# EAGLE design MiiScoreBoard (EAGLE 7.1.0)
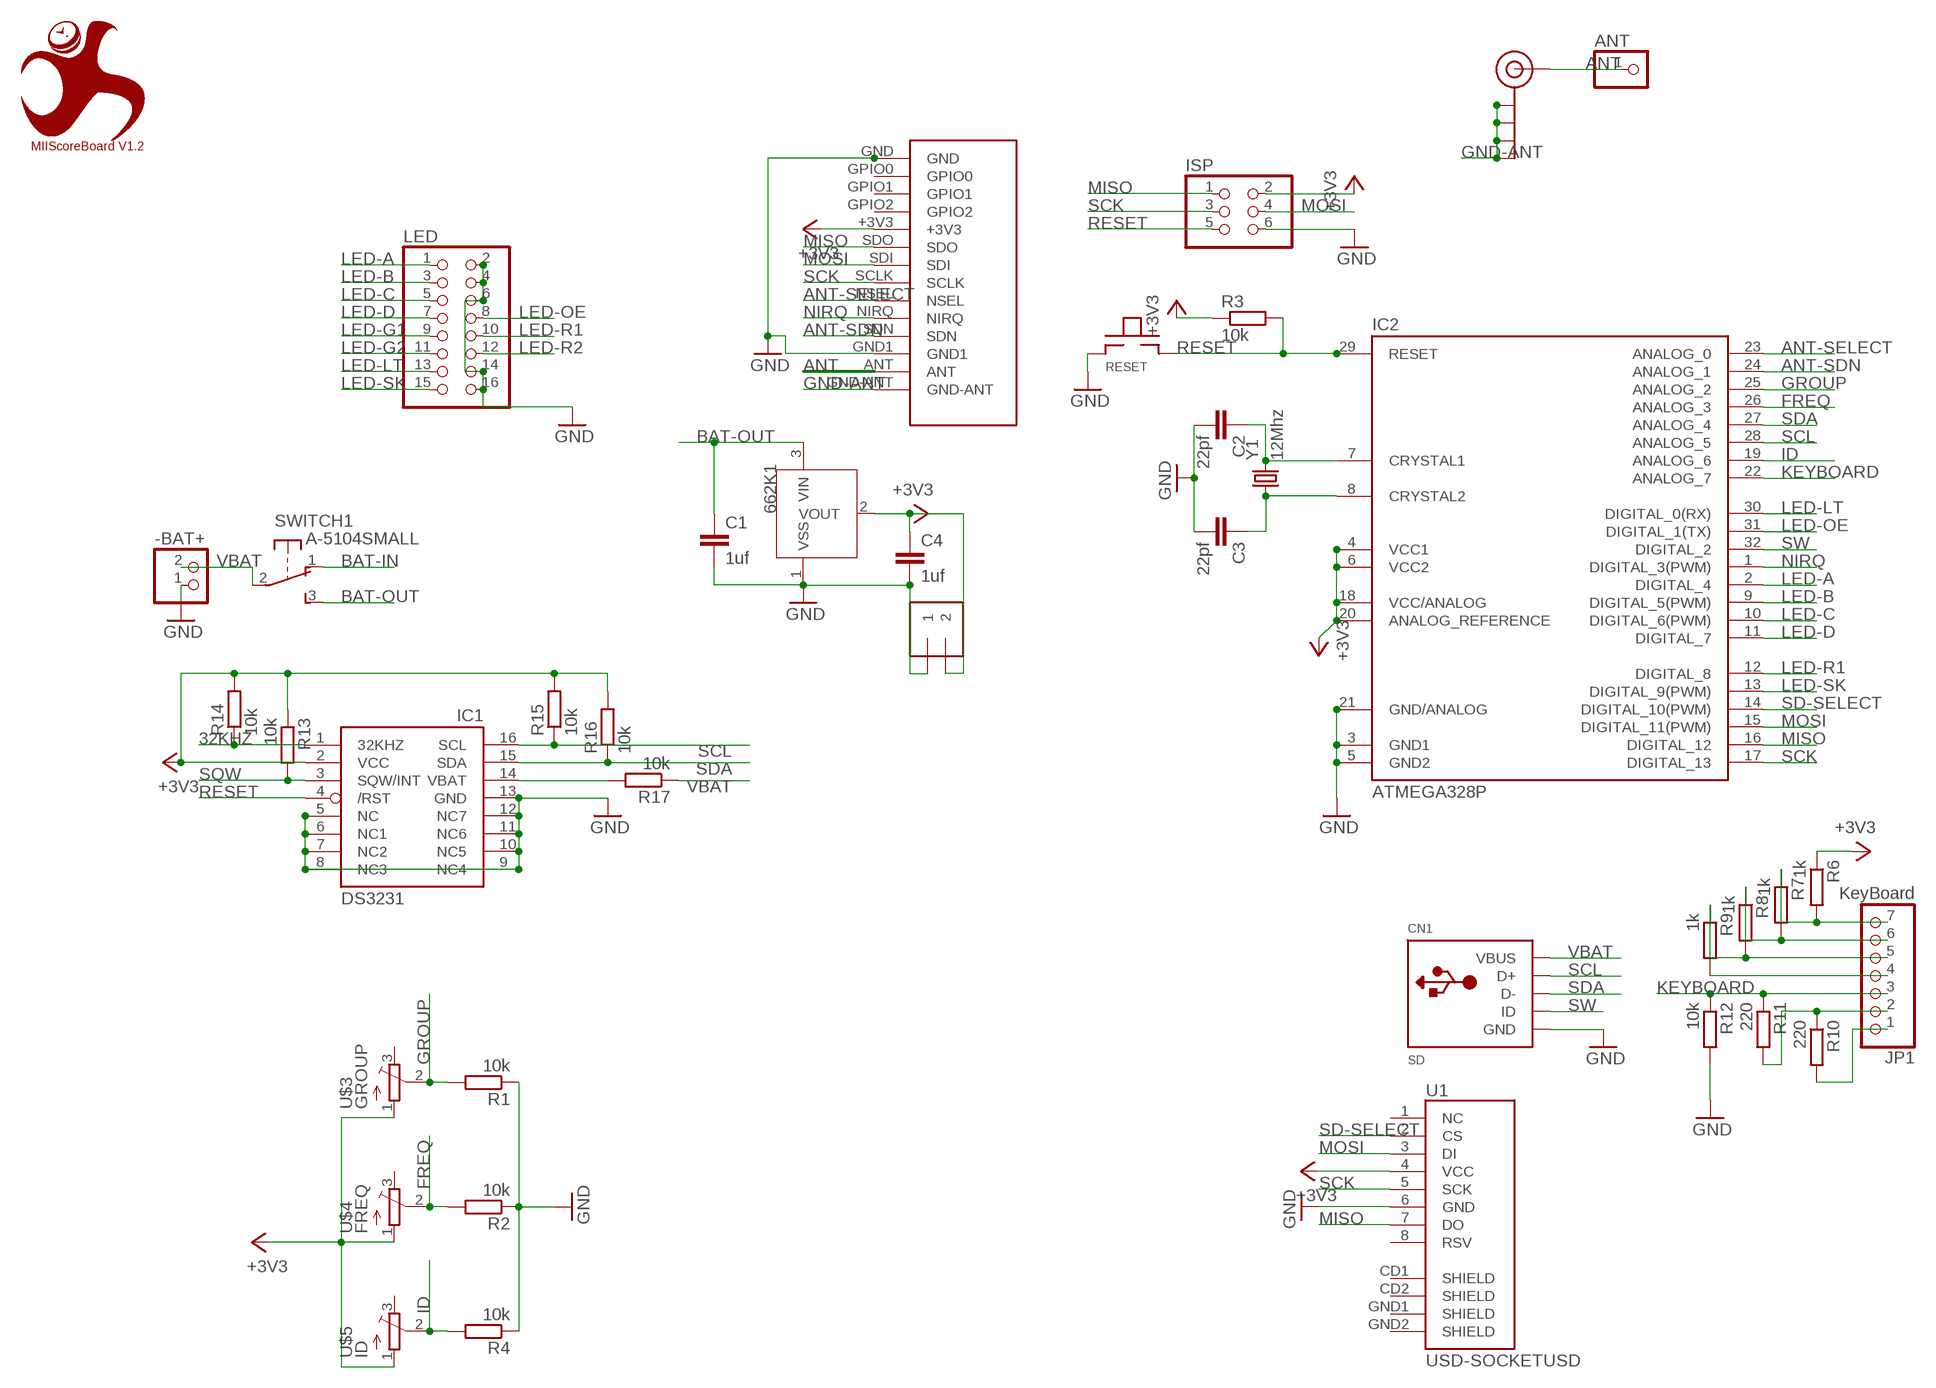
[diagram p0: schematic, sheet 1]

## Parts
662K1  XC6206  [SOT23]
+LED-  -BAT+  1X2-3.5MM  [1X2-3.5MM]
-BAT+  JST_2PIN-THM  [JST-PH-2-THM]
ANT  PINHD-1X01_2.00  [1X01M]
C1  1uf  C-EUC0805  [C0805]
C2  22pf  C-EUC0805  [C0805]
C3  22pf  C-EUC0805  [C0805]
C4  1uf  C-EUC0805  [C0805]
CN1  SD  USBMINIB  [USB-MINIB]
IC1  DS3231/SO  [SO16W]
IC2  ATMEGA328P  ATMEGA168-AU  [TQFP32-08]
ISP  PINHD-2X03_2.00  [2X03M]
J$1  SMA_EDGE  [SMA-EDGE]
JP1  KeyBoard  PINHD-1X07_2.54  [1X07]
LED  PINHD-2X08_2.54  [2X08]
R1  10k  R-EU_R0805  [R0805]
R2  10k  R-EU_R0805  [R0805]
R3  10k  R-EU_R0805  [R0805]
R4  10k  R-EU_R0805  [R0805]
R6  1k  R-EU_R0805  [R0805]
R7  1k  R-EU_R0805  [R0805]
R8  1k  R-EU_R0805  [R0805]
R9  1k  R-EU_R0805  [R0805]
R10  220  R-EU_R0805  [R0805]
R11  220  R-EU_R0805  [R0805]
R12  10k  R-EU_R0805  [R0805]
R13  10k  R-EU_R0805  [R0805]
R14  10k  R-EU_R0805  [R0805]
R15  10k  R-EU_R0805  [R0805]
R16  10k  R-EU_R0805  [R0805]
R17  10k  R-EU_R0805  [R0805]
RESET  TACT  [TACT-TS-1289]
SWITCH  A-5104SMALL  [A-5104-SMALL]
U1  USD-SOCKETUSD  [USD-SOCKET-PP]
U$1  MIIScoreBoard V1.2  MIICHRONO  [MIICHRONO]
U$3  GROUP  TRIMPOTTC33X  [TC33X]
U$4  FREQ  TRIMPOTTC33X  [TC33X]
U$5  ID  TRIMPOTTC33X  [TC33X]
U$7  SI4432  SPI4432  [SI4432]
Y1  12Mhz  CRYSTALSMD  [HC49UP]

## Nets
32KHZ: IC1.1(32KHZ) R14.1
+3V3 [supply]: 662K1.2(VOUT) +LED-.2 C4.1 IC1.2(VCC) IC2.4(VCC1) IC2.6(VCC2) IC2.18(VCC/ANALOG) IC2.20(ANALOG_REFERENCE) ISP.2 R3.1 R6.1 R13.1 R14.2 R15.2 R16.2 U1.4(VCC) U$3.1(A) U$4.1(A) U$5.1(A) U$7.+3V3
ANT [antenna]: ANT.1 J$1.SIG(SIGNAL) U$7.ANT
ANT-SDN: IC2.24(ANALOG_1) U$7.SDN
ANT-SELECT: IC2.23(ANALOG_0) U$7.NSEL
BAT-IN [supply]: SWITCH.1(1:O)
BAT-OUT [supply]: 662K1.3(VIN) C1.1 SWITCH.3(1:S)
FREQ: IC2.26(ANALOG_3) R2.2 U$4.2(S)
GND [supply]: 662K1.1(VSS) +LED-.1 -BAT+.1 C1.2 C2.2 C3.2 C4.2 CN1.GND IC1.5(NC) IC1.6(NC1) IC1.7(NC2) IC1.8(NC3) IC1.9(NC4) IC1.10(NC5) IC1.11(NC6) IC1.12(NC7) IC1.13(GND) IC2.3(GND1) IC2.5(GND2) IC2.21(GND/ANALOG) ISP.6 LED.2 LED.4 LED.6 LED.14 LED.16 R1.1 R2.1 R4.1 R12.2 RESET.TOP-1 U1.6(GND) U$7.GND U$7.GND1
GND-ANT [antenna]: J$1.GND@0(GND) J$1.GND@1(GND) J$1.GND@2(GND) J$1.GND@3(GND) U$7.GND-ANT
GROUP: IC2.25(ANALOG_2) R1.2 U$3.2(S)
ID: IC2.19(ANALOG_6) R4.2 U$5.2(S)
KEYBOARD: IC2.22(ANALOG_7) JP1.3 R11.1 R12.1
LED-A: IC2.2(DIGITAL_4) LED.1
LED-B: IC2.9(DIGITAL_5(PWM)) LED.3
LED-C: IC2.10(DIGITAL_6(PWM)) LED.5
LED-D: IC2.11(DIGITAL_7) LED.7
LED-G1: LED.9
LED-G2: LED.11
LED-LT: IC2.30(DIGITAL_0(RX)) LED.13
LED-OE: IC2.31(DIGITAL_1(TX)) LED.8
LED-R1: IC2.12(DIGITAL_8) LED.10
LED-R2: LED.12
LED-SK: IC2.13(DIGITAL_9(PWM)) LED.15
MISO: IC2.16(DIGITAL_12) ISP.1 U1.7(DO) U$7.SDO
MOSI: IC2.15(DIGITAL_11(PWM)) ISP.4 U1.3(DI) U$7.SDI
N$1: JP1.4 R9.2
N$2: JP1.7 R6.2 R7.1
N$3: JP1.6 R7.2 R8.1
N$4: JP1.5 R8.2 R9.1
N$5: JP1.1 R10.2
N$8: C3.1 IC2.8(CRYSTAL2) Y1.1
N$9: C2.1 IC2.7(CRYSTAL1) Y1.2
N$10: JP1.2 R10.1 R11.2
N$16: IC1.14(VBAT) R17.2
NIRQ: IC2.1(DIGITAL_3(PWM)) U$7.NIRQ
RESET: IC1.4(/RST) IC2.29(RESET) ISP.5 R3.2 RESET.BOT-2
SCK: IC2.17(DIGITAL_13) ISP.3 U1.5(SCK) U$7.SCLK
SCL: CN1.D+ IC1.16(SCL) IC2.28(ANALOG_5) R15.1
SD-SELECT: IC2.14(DIGITAL_10(PWM)) U1.2(CS)
SDA: CN1.D- IC1.15(SDA) IC2.27(ANALOG_4) R16.1
SQW: IC1.3(SQW/INT) R13.2
SW: CN1.ID IC2.32(DIGITAL_2)
VBAT [supply]: -BAT+.2 CN1.VBUS R17.1 SWITCH.2(1:P)
Unconnected: SWITCH.MT1(MT) SWITCH.MT2(MT) U1.1(NC) U1.8(RSV) U1.CD1(SHIELD) U1.CD2(SHIELD) U1.GND1(SHIELD) U1.GND2(SHIELD) U$3.3(E) U$4.3(E) U$5.3(E) U$7.GPIO0 U$7.GPIO1 U$7.GPIO2

## Library data of the parts
662K1 = MyLib:XC6206
+LED- = adafruit:1X2: 3.5mm Terminal block http://www.ladyada.net/library/pcb/eaglelibrary.html
-BAT+ = adafruit:JST_2PIN: JST 2-Pin Connectors of various flavors SMT-RA (S2B-PH-SM4) 4UConnector #17311 SMT (B2B-PH-SM4) THM-RA (S2B-PH) THM (B2B-PH)
ANT = pinhead-2:PINHD-1X01: PIN HEADER
C1-C4 = rcl:C-EU: CAPACITOR, European symbol
CN1 = adafruit:USB: USB Connectors USBMINIB - Surface Mount Female Mini-B USB Connector 4UConnector: 06564 By microbuilder.eu Thru-hole RA Female Mini-B USB Connector 4UConnector: 18732 By ladyada.net
IC1 = adafruit:DS3231
IC2 = Arduino-AVR:ATMEGA168
ISP = pinhead-2:PINHD-2X03: PIN HEADER
J$1 = SparkFun:SMA_EDGE: SMA Antenna Connector End launch SMA connector. The paste layer has been removed so that the connector can be hand soldered onto the board after reflow.
JP1 = pinhead-2:PINHD-1X07: PIN HEADER
LED = pinhead-2:PINHD-2X08: PIN HEADER
R1-R4 R6-R17 = rcl:R-EU_: RESISTOR, European symbol
RESET = MyLib:TACT
SWITCH = MyLib:A-5104: E-Switch right-angle slide SPDT Ebay and taydaElectronics A-5014
U1 = MyLib:USD-SOCKET: microSD Socket Part found on EBay
U$1 = MyLib:MIICHRONO
U$3-U$5 = MyLib:TRIMPOT: SMT trimmer potentiometer part number TC33X http://www.ladyada.net/library/eagle
U$7 = MyLib:SPI4432
Y1 = SparkFun:CRYSTAL: Crystals Various standard crystals. Proven footprints. Spark Fun Electronics SKU : COM-00534

## Net classes
0 default: width 0.203 mm
1 supply: width 0.254 mm
2 antenna: width 0.254 mm

## Board
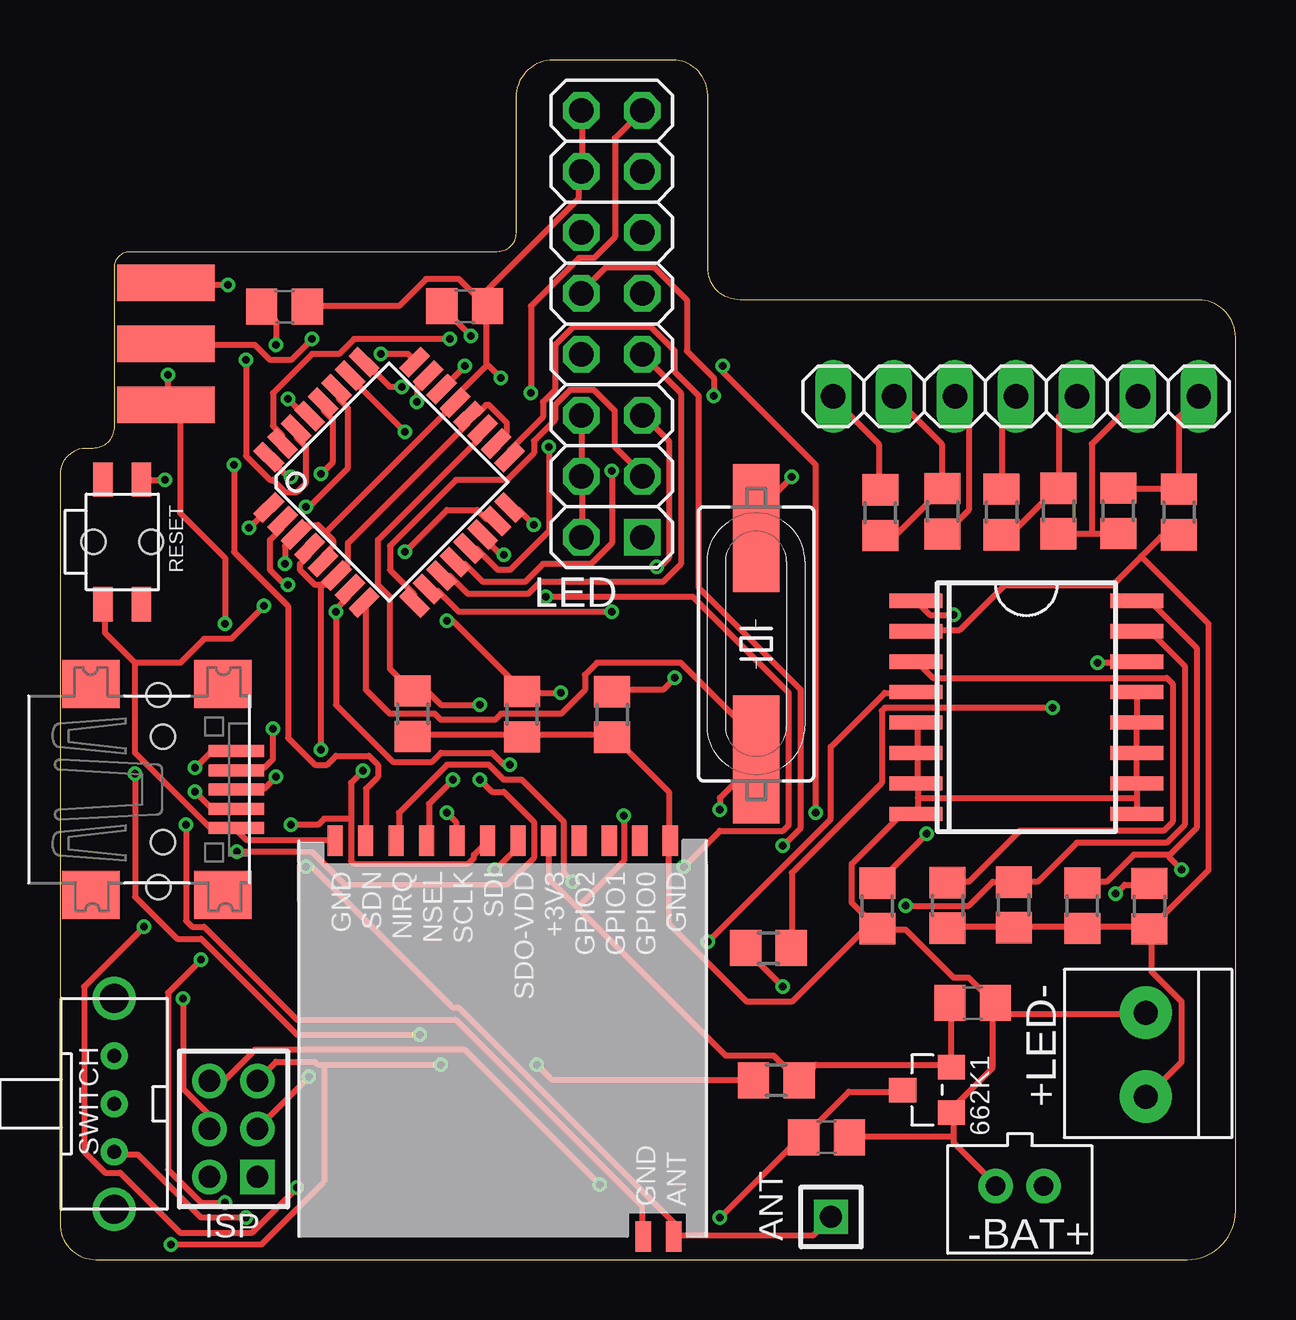
[diagram p1: board, top side]
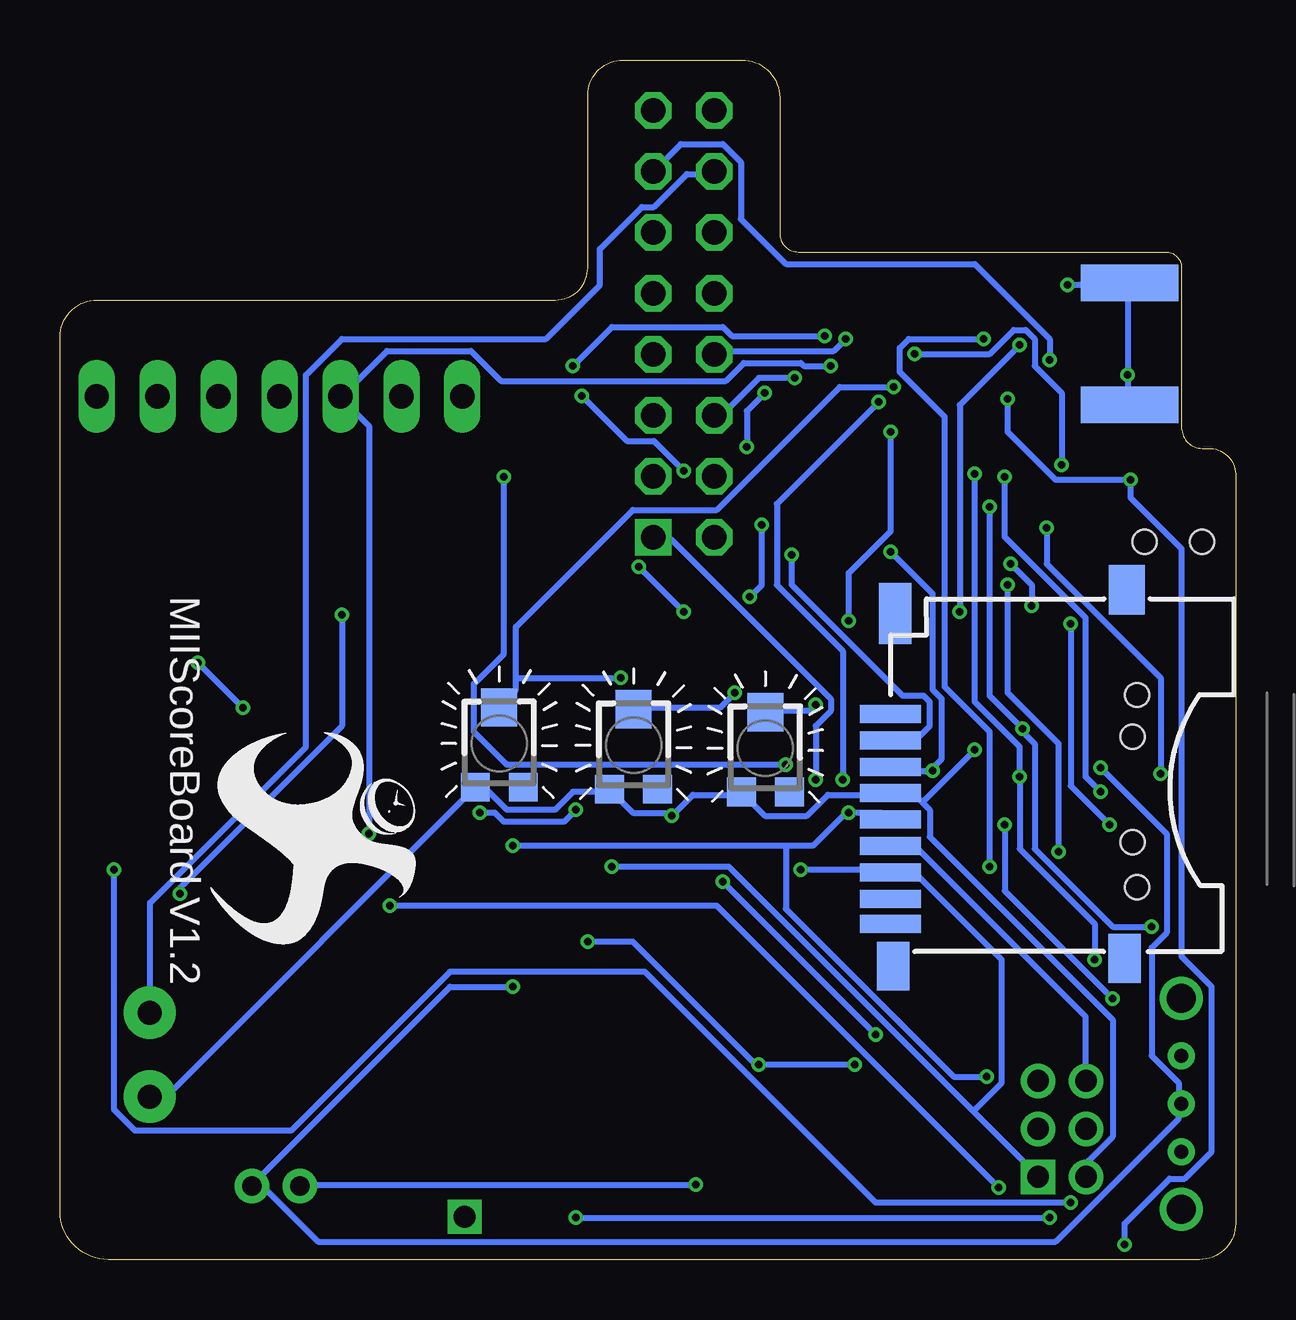
[diagram p2: board, bottom side, seen from below]

Size 49 x 50 mm. Coordinates in mm from the lower left corner, seen from the top.
Outline: 1.5,0 46.99,0 arc90 49,2.01 49,38.44 arc90 47.44,40 28.34,40 arc-90 27,41.34 27,48.53 arc90 25.53,50 20.58,50 arc90 19,48.42 19,42.78 arc-90 18.22,42 2.92,42 arc90 2.25,41.33 2.25,34.73 arc-90 1.39,33.81 1.13,33.81 arc90 0,32.74 0,1.5 arc90 1.5,0
Copper layers (1*16): Top 0.035mm / dielectric 1.5mm / Bottom 0.035mm
Design rules "SierkSeed *": minimum track width 10mil, minimum drill 12mil, track to track 6mil, track to pad 6mil, pad to pad 6mil, via to via 6mil, smd to smd 0mil, copper to edge 10mil, drill to drill 10mil, minimum pad ring 10mil, minimum via ring 6mil, stop-mask expansion 2mil, vias tented up to drill 100mil, thermal gap 10mil

### Footprints (pad centres in the part's own frame; a part is rotated, then mirrored left to right if it is on the bottom)
SOT23 = smd 1.016 x 1.143: 1 -0.95,-1.016; 2 0.95,-1.016; 3 0,1.016
1X2-3.5MM = drill 1 pad 2.184: 1 1.8,0; 2 -1.7,0
JST-PH-2-THM = drill 0.8 pad 1.422: 1 1,0; 2 -1,0
1X01M = drill 0.914 square: 1 0,0
C0805 = smd 1.3 x 1.5: 1 -0.95,0; 2 0.95,0
USB-MINIB = smd 0.5 x 2.308: D+ 0,4.064; D- -0.8,4.064; GND 1.6,4.064; ID 0.8,4.064; VBUS -1.6,4.064 | smd 2 x 2.4: GND1 -4.4,-2; GND2 -4.4,3.5; GND3 4.4,3.5; GND4 4.4,-2 | hole 1: -2.2,1; 2.2,1
SO16W = smd 0.6 x 2.2: 1 -4.445,-4.6; 2 -3.175,-4.6; 3 -1.905,-4.6; 4 -0.635,-4.6; 5 0.635,-4.6; 6 1.905,-4.6; 7 3.175,-4.6; 8 4.445,-4.6; 9 4.445,4.6; 10 3.175,4.6; 11 1.905,4.6; 12 0.635,4.6; 13 -0.635,4.6; 14 -1.905,4.6; 15 -3.175,4.6; 16 -4.445,4.6
TQFP32-08 = smd 1.27 x 0.559: 1 -4.293,2.8; 2 -4.293,2; 3 -4.293,1.2; 4 -4.293,0.4; 5 -4.293,-0.4; 6 -4.293,-1.2; 7 -4.293,-2; 8 -4.293,-2.8; 17 4.293,-2.8; 18 4.293,-2; 19 4.293,-1.2; 20 4.293,-0.4; 21 4.293,0.4; 22 4.293,1.2; 23 4.293,2; 24 4.293,2.8 | smd 0.559 x 1.27: 9 -2.8,-4.293; 10 -2,-4.293; 11 -1.2,-4.293; 12 -0.4,-4.293; 13 0.4,-4.293; 14 1.2,-4.293; 15 2,-4.293; 16 2.8,-4.293; 25 2.8,4.293; 26 2,4.293; 27 1.2,4.293; 28 0.4,4.293; 29 -0.4,4.293; 30 -1.2,4.293; 31 -2,4.293; 32 -2.8,4.293
2X03M = drill 0.914 square: 1 -2,-1 | drill 0.914: 2 -2,1; 3 0,-1; 4 0,1; 5 2,-1; 6 2,1
SMA-EDGE = smd 1.524 x 4.064: GND@0 0,0; GND@1 5.08,0; SIG 2.54,0 | smd 1.524 x 4.064 bottom: GND@2 0,0; GND@3 5.08,0
1X07 = drill 1.016 long: 1 -7.62,0; 2 -5.08,0; 3 -2.54,0; 4 0,0; 5 2.54,0; 6 5.08,0; 7 7.62,0
2X08 = drill 1.016 square: 1 -8.89,-1.27 | drill 1.016 octagon: 2 -8.89,1.27; 3 -6.35,-1.27; 4 -6.35,1.27; 5 -3.81,-1.27; 6 -3.81,1.27; 7 -1.27,-1.27; 8 -1.27,1.27; 9 1.27,-1.27; 10 1.27,1.27; 11 3.81,-1.27; 12 3.81,1.27; 13 6.35,-1.27; 14 6.35,1.27; 15 8.89,-1.27; 16 8.89,1.27
R0805 = smd 1.3 x 1.5: 1 -0.95,0; 2 0.95,0
TACT-TS-1289 = smd 1.422 x 0.813: BOT-1 -2.6,-0.8; BOT-2 2.6,-0.8; TOP-1 -2.6,0.8; TOP-2 2.6,0.8 | hole 1: 0,1.2; 0,-1.2
A-5104-SMALL = drill 0.6: 1 -2,0; 2 0,0; 3 2,0 | drill 1.2: MT1 -4.4,0; MT2 4.4,0
USD-SOCKET-PP = smd 0.75 x 2.54: 1 3.2,17.018; 2 2.1,17.018; 3 1,17.018; 4 -0.1,17.018; 5 -1.2,17.018; 6 -2.3,17.018; 7 -3.4,17.018; 8 -4.5,17.018; CD1 -5.55,17.018 | smd 2.046 x 1.35: CD2 -6.995,7.25 | smd 2.008 x 1.35: GND1 -7.313,16.905 | smd 2.07 x 1.5: GND2 8.379,7.165 | smd 2.54 x 1.35: P$1 7.38,16.82 | hole 1: 3.99,6.73; -4.02,6.73
TC33X = smd 1.2 x 1.2: 1 -1,-1.825; 3 1,-1.825 | smd 1.5 x 1.6: 2 0,1.5
SI4432 = smd 0.635 x 1.27: +3V3 6.59,0; ANT 1.37,16.51; GND 1.51,0; GND1 15.48,0; GND-ANT 2.64,16.51; GPIO0 2.78,0; GPIO1 4.05,0; GPIO2 5.32,0; NIRQ 12.94,0; NSEL 11.67,0; SCLK 10.4,0; SDI 9.13,0; SDN 14.21,0; SDO 7.86,0
HC49UP = smd 5.334 x 1.93: 1 -4.826,0; 2 4.826,0

### Placement (x,y rotation side)
662K1  36.14,7.07 90 top
+LED-  45.26,8.49 90 top
-BAT+  40,3.06 180 top
ANT  32.14,1.78 0 top
C1  31.95,5.1 0 top
C2  9.36,39.71 0 top
C3  16.87,39.73 0 top
C4  38.04,10.69 0 top
CN1  3.29,19.59 270 top
IC1  40.28,23.02 270 top
IC2  13.72,32.4 45 top
ISP  7.23,5.44 90 top
J$1  4.41,35.63 90 top
JP1  39.85,35.98 0 top
LED  23,39 90 top
R1  23.02,22.72 90 top
R2  19.26,22.73 90 top
R3  29.86,7.47 180 top
R4  14.7,22.75 90 top
R6  46.64,31.16 90 top
R7  44.11,31.21 270 top
R8  41.62,31.2 90 top
R9  39.24,31.16 90 top
R10  34.19,31.13 90 top
R11  36.79,31.19 90 top
R12  34.07,14.74 270 top
R13  36.99,14.76 90 top
R14  45.41,14.73 270 top
R15  42.61,14.75 270 top
R16  39.75,14.78 270 top
R17  29.53,12.98 0 top
RESET  2.6,29.91 90 top
SWITCH  2.26,6.49 270 top
U1  -2.63,19.54 90 bottom
U$1  42.72,21.97 270 bottom
U$3  30.69,21.51 0 bottom
U$4  25.09,21.43 0 bottom
U$5  19.6,21.31 0 bottom
U$7  26.95,17.46 180 top
Y1  29.02,25.66 90 top

### Tracks (layer width: path | path; a pad name or v marks a point on that pad's centre or on a via)
32KHZ  (via drill 0.3)
  Top 0.254: v44,15.25 44.38,15.62 45.38,15.62 R14.1 | v37.25,26.88 36.25,26.88 35.75,27.38 IC1.1
  Bottom 0.254: v44,15.25 44,15.5 37.25,22.25 v37.25,26.88
+3V3  (via drill 0.3)
  Top 0.254: 45.06,29.31 43.88,28.12 39.38,28.12 37.5,26.25 35.75,26.25 IC1.2 | 45.06,29.31 45.88,30.12 46.62,30.12 R6.1 | R13.1 37,13.88 39.75,13.88 R16.2 39.88,13.88 42.5,13.88 R15.2 42.62,13.88 45.38,13.88 R14.2 | R14.2 45.5,13.75 45.5,12 46.75,10.75 46.75,8.25 45.38,6.88 +LED-.2 | 45.06,29.31 47.88,26.5 47.88,16.25 45.5,13.88 R14.2 | C4.1 37.12,10.62 37.12,8.12 662K1.2 37,8.12 31.5,8.12 30.88,7.5 R3.1 30.75,7.5 29.75,8.5 27.75,8.5 21.56,14.69 | 21.56,14.69 20.38,15.88 20.38,17.38 U$7.+3V3 | IC2.18 18.25,34.12 18.62,34.5 18.62,34.88 17.88,35.62 17.75,35.62 17.38,35.25 17.12,35.25 IC2.20 17,35.12 17,34.88 12,29.88 12,29 11.62,28.62 IC2.6 11.5,28.5 11.12,28.12 10.88,28.12 | 10.88,28.12 10.62,28.12 10,28.75 10,29 10.38,29.38 10.38,29.62 IC2.4 | v10.88,21.25 10.88,28.12 | 21.56,14.69 23.5,16.62 v23.5,18.5
  Bottom 0.254: 23.5,18.62 25.12,18.62 26,19.5 U$4.1 26.12,19.5 27.62,19.5 28.38,18.75 30.38,18.75 31.25,19.62 31.62,19.62 U$3.1 44.5,6.88 45.25,6.88 +LED-.2 | 23.5,18.62 23.38,18.62 22.62,19.38 20.62,19.38 U$5.1 20.5,19.38 19.62,18.5 17.88,18.5 17,19.38 14.5,19.38 U1.4 14.38,19.38 13.38,19.38 13.06,19.06 | 13.06,19.06 12.75,18.75 12.75,17.62 5.12,10 5.12,5.12 6.12,4.12 6.12,3.5 ISP.2 | 13.06,19.06 v10.88,21.25 | v23.5,18.5 23.5,18.62
ANT  (via drill 0.3)
  Top 0.254: ANT.1 32.12,1.75 31.38,1 25.62,1 U$7.ANT 25.62,1.12 25.62,1.5 16.62,10.5 16.38,10.5 10.5,16.38 v10.25,16.38 | v10.5,38.38 9.62,37.5 8.75,37.5 8.12,38.12 4.5,38.12 J$1.SIG
  Bottom 0.254: v10.5,38.38 13.62,38.38 14,38 14,37 12.12,35.12 12.12,23.88 10.25,22 v10.25,16.38
ANT-SDN  (via drill 0.3)
  Top 0.254: v7.25,33.12 7.25,29.5 9.5,27.25 9.5,21.75 10.62,20.62 11.12,20.62 11.5,21 12.88,21 13.25,20.62 13.25,20.12 12.75,19.62 12.75,17.5 U$7.SDN | v13.38,37.75 14.5,37.75 14.75,37.5 IC2.24
  Bottom 0.254: v7.25,33.12 7.25,36.12 8.38,37.25 8.38,38.38 8.75,38.75 9.25,38.75 10.25,37.75 v13.38,37.75
ANT-SELECT  (via drill 0.3)
  Top 0.254: v16.38,20 15.38,19 15.38,17.5 U$7.NSEL | v14.88,35.75 14.88,36.38 15.25,36.75 IC2.23
  Bottom 0.254: v16.38,20 16.38,25.38 19.12,28.12 19.12,31.5 v14.88,35.75
BAT-OUT  (via drill 0.3)
  Top 0.254: 662K1.3 35,7 32.88,7 31,5.12 C1.1 30.88,5.12 v27.5,1.75 | v7.75,1.75 5.88,1.75 3.25,4.38 2.38,4.38 SWITCH.3
  Bottom 0.254: v27.5,1.75 v7.75,1.75
FREQ  (via drill 0.3)
  Top 0.254: v14.38,34.5 12.12,36.75 IC2.26 | v16.12,26.62 16.38,26.62 19.25,23.75 R2.2 19.38,23.62 v20.88,23.62
  Bottom 0.254: v14.38,34.5 14.38,30.38 16.12,28.62 v16.12,26.62 | v20.88,23.62 21.5,23 25,23 U$4.2
GND  (via drill 0.3)
  Top 0.254: U$7.GND1 11.38,17.5 7.75,17.5 7.38,17.88 CN1.GND 7.25,18 6.25,18 3.12,21.12 3.12,24.88 | 3.12,24.88 1.88,26.12 1.88,27.25 RESET.TOP-1 | LED.2 21.75,30.12 21.75,32.62 LED.4 21.75,32.75 21.75,35.12 LED.6 | LED.16 21.75,47.88 21.75,45.38 LED.14 21.62,45.25 21.62,44.25 17.5,40.12 C3.2 | 11.06,30.31 10.75,30.62 10.25,30.62 9.88,30.25 IC2.3 9.75,30.12 9.38,29.75 v9.38,29 | 11.06,30.31 11.38,30 11.38,29.75 11,29.38 11,29.12 IC2.5 | 17.75,37.25 16.5,36 16.5,35.75 IC2.21 16.38,35.62 11.06,30.31 | 17.75,37.25 17.75,39.62 C3.2 | C2.2 10.38,39.75 14.12,39.75 15.25,40.88 16.62,40.88 17.75,39.75 C3.2 | v18.38,36.75 17.88,37.25 17.75,37.25 | 3.12,24.88 5,24.88 6,25.88 7.12,25.88 v8.5,27.25 | R4.1 14.75,21.88 19.25,21.88 R2.1 19.38,21.88 23,21.88 R1.1 23.12,21.75 25.38,19.5 25.38,17.5 U$7.GND 25.38,17.38 25.38,14 28.62,10.75 30.5,10.75 33.75,14 R12.2 | IC1.13 44.88,23.62 44.88,22.5 IC1.12 44.88,21.12 IC1.11 44.88,21 44.88,19.88 IC1.10 44.88,19.75 44.88,19.25 | 44.88,19.25 44.88,18.62 IC1.9 | 35.75,19.25 35.75,19.75 IC1.7 35.75,19.88 35.75,21 IC1.6 35.75,21.12 35.75,22.38 IC1.5 | 35.75,19.25 35.75,18.62 IC1.8 35.62,18.5 35,18.5 33,16.5 33,14.88 34,13.88 R12.2 | 37.25,5.12 37.25,4.88 39,3.12 -BAT+.1 | 37.25,5.12 37.25,6 662K1.1 37.12,6.25 38.88,8 38.88,10.62 C4.2 | 37.25,5.12 33,5.12 C1.2 | R12.2 34.12,13.75 35.25,13.75 37.25,11.75 37.88,11.75 38.88,10.75 C4.2 | 35.75,19.25 44.88,19.25 | +LED-.1 45.25,10.25 39,10.25 C4.2 | v22.5,3.12 16.88,8.75 8.12,8.75 6.88,7.5 6.25,7.5 ISP.6
  Bottom 0.254: v18.38,36.75 19.88,36.75 21.38,35.25 21.62,35.25 LED.6 | v8.5,27.25 8.5,28.12 v9.38,29 | U1.6 14.38,17.12 13.25,17.12 6.25,10.12 6.25,7.5 ISP.6 | v22.5,3.12 39,3.12 -BAT+.1 | LED.14 21.75,45.25 22.88,45.25 24.25,43.88 24.75,43.88 26.5,42.12 26.5,40.62 28.75,38.38 37.25,38.38 38.75,36.88 38.75,21.38 45.25,14.88 45.25,10.38 +LED-.1
GND-ANT  (via drill 0.3)
  Top 0.254: v7,40.62 4.5,40.62 J$1.GND@3 | v5.25,18.12 5.25,14.12 5.5,13.88 6,13.88 9.88,10 16.5,10 24.25,2.25 24.25,1 U$7.GND-ANT | v6.88,26.5 6.88,29.25 5,31.12 5,35.12 4.5,35.62 J$1.GND@2 4.5,35.75 v4.5,36.88
  Bottom 0.254: J$1.GND@2 4.5,35.75 v4.5,36.88 4.5,40.62 J$1.GND@3 4.62,40.62 v7,40.62 | v5.25,18.12 6.88,19.75 v6.88,26.5
GROUP  (via drill 0.3)
  Top 0.254: v14.25,36.38 13.75,36.38 12.75,37.38 IC2.25 | v25.62,24.25 25.12,23.75 23.12,23.75 R1.2
  Bottom 0.254: v14.25,36.38 16.5,36.38 21.62,31.25 25.12,31.25 30,26.38 30,24.25 | 30,24.25 30,23.75 30.62,23.12 U$3.2 | 30,24.25 v25.62,24.25
ID  (via drill 0.3)
  Top 0.254: IC2.19 17.5,34.5 17.5,34.25 13.25,30 13.25,28.12 13.75,27.62 13.75,24.62 14.62,23.75 R4.2 14.75,23.62 15.38,23.62 15.88,23.12 v17.5,23.12
  Bottom 0.254: v17.5,23.12 17.75,22.88 19.5,22.88 U$5.2
KEYBOARD  (via drill 0.3)
  Top 0.254: v16.88,37.25 16,36.38 IC2.22 | v36.12,17.75 34.12,15.75 R12.1 | R11.1 36.88,30.25 37.88,31.25 37.88,35.38 37.38,35.88 JP1.3
  Bottom 0.254: v16.88,37.25 18,37.25 18.12,37.38 20.5,37.38 21.25,36.62 30.62,36.62 31.88,37.88 35.38,37.88 37.25,36 JP1.3 37.25,35.88 36.12,34.75 v36.12,17.75
LED-A  (via drill 0.3)
  Top 0.254: v9.5,28.12 9.38,28.12 8.75,28.75 8.75,30 9.25,30.5 9.25,30.75 IC2.2 | v7.38,17 10.5,17 11.88,15.62 18.62,15.62 19.75,16.75 19.75,18.25 18.5,19.5 18,19.5 v17.5,20
  Bottom 0.254: v9.5,28.12 9.5,23.62 7.38,21.5 v7.38,17 | v17.5,20 17.5,22.25 16.88,22.88 16.88,23.38 23.5,30 24.25,30 LED.1
LED-B
  Top 0.254: IC2.9 14.75,27.5 14.75,27.75 13.75,28.75 13.75,29.75 16.5,32.5 18.62,32.5 19.75,33.62 19.75,34.12 20.62,35 20.62,35.62 21.25,36.25 22.25,36.25 23.12,35.38 23.12,33.88 24.25,32.75 LED.3
LED-C  (via drill 0.3)
  Top 0.254: v23,27 16.62,27 15.75,27.88 15.38,27.88 IC2.10 | v24.88,28.88 25,28.88 25.38,29.25 25.38,34.12 24.38,35.12 LED.5
  Bottom 0.254: v24.88,28.88 v23,27
LED-D
  Top 0.254: LED.7 25.88,36.12 25.88,29 25.12,28.25 20,28.25 19.5,27.75 17,27.75 16.25,28.5 16,28.5 IC2.11
LED-LT  (via drill 0.3)
  Top 0.254: v7.75,37.5 7.75,33.5 8.75,32.5 8.88,32.5 9.38,32 9.88,32 10.25,32.38 10.25,33.88 9.88,34.25 9.88,34.5 IC2.30
  Bottom 0.254: v7.75,37.5 7.75,38.38 10.88,41.5 18.75,41.5 20.62,43.38 20.62,45.75 21.38,46.5 23.12,46.5 24.25,45.38 LED.13
LED-OE  (via drill 0.3)
  Top 0.254: v16.25,38.38 12.25,38.38 11.62,37.75 10.5,37.75 8.88,36.12 8.88,34.75 9.25,34.38 9.25,34.12 IC2.31
  Bottom 0.254: v16.25,38.38 16.75,37.88 21.5,37.88 21.62,37.75 LED.8
LED-R1  (via drill 0.3)
  Top 0.254: v23,32.88 23,29.88 22.12,29 20.12,29 19.38,28.25 17.62,28.25 16.88,29 16.5,29 IC2.12 | v27.25,36 27.25,36.75 26.12,37.88 26.12,40 24.75,41.38 22.75,41.38 21.75,40.38 LED.10
  Bottom 0.254: v23,32.88 24.25,34.12 25.38,34.12 v27.25,36
LED-SK  (via drill 0.3)
  Top 0.254: v20.38,33.88 20.38,30.38 18.75,28.75 18.25,28.75 17.38,29.62 17.12,29.62 IC2.13 | v19.62,36.12 19.62,39.75 21.62,41.75 22.25,41.75 23.12,42.62 23.12,46.75 24.25,47.88 LED.15
  Bottom 0.254: v20.38,33.88 20.38,35.38 v19.62,36.12
MISO  (via drill 0.3)
  Top 0.254: v18.12,16.25 19,17.12 19,17.38 U$7.SDO | v19.75,30.62 19.12,31.25 18.75,31.25 IC2.16 | v20.25,27.62 26.38,27.62 30.38,23.62 30.38,18.12 30.12,17.88 27.5,17.88 v26,16.38
  Bottom 0.254: v18.12,16.25 14.5,16.25 U1.7 14.38,16.12 13.38,16.12 9.75,12.5 9.75,7.38 10.94,6.19 | v19.75,30.62 19.75,28.12 v20.25,27.62 | v26,16.38 21.12,16.38 10.94,6.19 | 10.94,6.19 8.25,3.5 ISP.1
MOSI  (via drill 0.3)
  Top 0.254: 12.12,18.38 12.12,19.88 v12.62,20.38 | 12.12,18.38 12.12,16.62 12.25,16.5 17,16.5 17.25,16.75 17.25,16.88 17.75,17.38 U$7.SDI | v14.38,29.5 16.12,31.25 17.38,31.25 17.75,30.88 18.12,30.88 IC2.15 | v5.12,10.88 5.12,7.12 6.12,6.12 6.12,5.5 ISP.4 | v9.62,18.12 10.75,18.12 11,18.38 12.12,18.38
  Bottom 0.254: U1.3 14.38,20.5 14.25,20.38 v12.62,20.38 12.62,20.5 12.25,20.88 12.25,23.38 12.62,23.75 12.62,27.75 v14.38,29.5 | v5.12,10.88 9.62,15.38 v9.62,18.12
N$1
  Top 0.254: R9.2 39.25,32.12 39.25,35.38 39.75,35.88 JP1.4
N$2
  Top 0.254: R7.1 44.12,32.12 46.62,32.12 R6.2 46.62,32.25 46.62,35.12 47.38,35.88 JP1.7
N$3
  Top 0.254: 43,30.25 44,30.25 R7.2 | 43,30.25 R8.1 | 43,30.25 43,34 44.88,35.88 JP1.6
N$4
  Top 0.254: R9.1 39.25,30.25 39.62,30.25 41.5,32.12 R8.2 41.62,32.25 41.62,35.12 42.38,35.88 JP1.5
N$5
  Top 0.254: R10.2 34.12,32.12 34.12,34 32.25,35.88 JP1.1
N$8  (via drill 0.3)
  Top 0.254: IC2.8 12.75,27.38 12.75,23.75 13.75,22.75 15.62,22.75 15.88,22.5 18.12,22.5 18.38,22.75 20.88,22.75 21.88,23.75 21.88,24.38 22.38,24.88 25.88,24.88 29,21.75 29,20.88 Y1.1 29,20.75 27.5,19.25 v27.5,18.75 | v17.12,38.5 16,39.62 C3.1 | v27.62,37.25 27.62,37 31.5,33.12 v31.5,18.62
  Bottom 0.254: v17.12,38.5 21,38.5 21.38,38.88 26,38.88 v27.62,37.25 | v31.5,18.62 30.88,18.62 30.5,18.25 28,18.25 v27.5,18.75
N$9  (via drill 0.3)
  Top 0.254: v9,38.12 9,39.12 8.5,39.62 C2.1 | IC2.7 12,27.88 12,27.62 11.5,27.12 v11.5,27 11.5,23.12 13.88,20.75 15.5,20.75 15.88,21.12 18,21.12 18.5,20.62 v18.75,20.62 | v30.5,32.62 29.12,31.25 29.12,30.5 Y1.2
  Bottom 0.254: v11.5,27 11.5,35.62 v9,38.12 | v30.5,32.62 30.5,25.25 31.75,24 31.75,22 30.38,20.62 v18.75,20.62
N$10
  Top 0.254: R10.1 34.25,30.25 34.88,30.25 36.75,32.12 R11.2 36.75,32.25 36.75,34 JP1.2
N$16  (via drill 0.3)
  Top 0.254: v41.38,23 34.38,23 34.25,22.88 34.25,19.88 30.5,16.12 30.5,13 R17.2 | v43.25,24.88 44.88,24.88 IC1.14
  Bottom 0.254: v43.25,24.88 v41.38,23
NIRQ  (via drill 0.3)
  Top 0.254: v21.38,15.75 21,16.12 21,18.25 19.25,20 18.5,20 17.88,20.62 16.12,20.62 14.12,18.62 14.12,17.5 U$7.NIRQ | v15,9.38 9.88,9.38 5.88,13.38 4.88,13.38 3.12,15.12 v3.12,20.25 | v7.88,30.5 8.62,31.25 IC2.1
  Bottom 0.254: v15,9.38 v21.38,15.75 | v3.12,20.25 3.12,24.25 7.88,29 v7.88,30.5
RESET  (via drill 0.3)
  Top 0.254: v9.5,35.88 10.12,35.25 10.38,35.25 IC2.29 | v4.38,32.5 3.5,32.5 RESET.BOT-2 | v19.88,8.12 20.5,7.5 28.88,7.5 R3.2 | 11,8.12 10.75,8.12 10.62,8.25 9,8.25 8.25,7.5 ISP.5 | 11,8.12 v15.88,8.12 | v27,13.25 32.12,18.38 32.12,21.38 34.38,23.62 35.62,23.62 IC1.4 | v4.62,0.62 8.38,0.62 11,3.25 11,8.12
  Bottom 0.254: v9.5,35.88 9.5,34.5 7.5,32.5 v4.38,32.5 4.38,31.75 2.25,29.62 2.25,12.62 1,11.38 1,4.5 2.12,3.38 2.75,3.38 4.62,1.5 v4.62,0.62 | v15.88,8.12 v19.88,8.12 20,8.12 25.12,13.25 v27,13.25
SCK  (via drill 0.3)
  Top 0.254: v16.12,18.62 16.5,18.25 16.5,17.5 U$7.SCLK | v30.12,17.25 30.88,18 30.88,23.75 26.62,28 26.62,36 25.62,37 25.62,37.88 24.62,38.88 21.38,38.88 20.62,38.12 20.62,36.25 20.12,35.75 20.12,35.12 18.75,33.75 18.75,33.5 IC2.17 | v10.38,7.62 8.25,5.5 ISP.3
  Bottom 0.254: U1.5 14.5,18.38 14.75,18.62 v16.12,18.62 16.25,18.62 17.62,17.25 18.75,17.25 | 18.75,17.25 v30.12,17.25 | v10.38,7.62 11.75,7.62 18.75,14.62 18.75,17.25
SCL  (via drill 0.3)
  Top 0.254: 46.25,16.88 44.75,16.88 43.62,15.75 42.62,15.75 R15.1 | 46.25,16.88 47.38,18 47.38,25.5 45.5,27.38 45,27.38 IC1.16 | v10.88,32.75 11.38,33.25 11.38,35 11,35.38 11,35.62 IC2.28 | v9,20.12 8.5,19.62 7.38,19.62 CN1.D+ | v46.75,16.25 46.25,16.75 46.25,16.88 | v6.88,2.38 5.88,2.38 4.5,3.75 4.5,11.12 v5.88,12.5
  Bottom 0.254: v10.88,32.75 10.88,23.25 9,21.38 v9,20.12 9,17.12 5.88,14 v5.88,12.5 | v46.75,16.25 46.75,6.25 45.88,5.38 39.38,5.38 32.75,12 24.62,12 15,2.38 v6.88,2.38
SD-SELECT  (via drill 0.3)
  Top 0.254: v18.5,29.38 18.38,29.38 17.62,30.12 IC2.14
  Bottom 0.254: v18.5,29.38 18.5,28.12 13.88,23.5 13,23.5 12.75,23.25 12.75,22.25 13.25,21.75 14.38,21.75 U1.2
SDA  (via drill 0.3)
  Top 0.254: IC1.15 45,26.12 45.5,26.12 46.88,24.75 46.88,18.12 46.12,17.38 42.38,17.38 40.75,15.75 39.75,15.75 R16.1 39.62,15.75 38.88,15.75 37.88,14.75 v35.25,14.75 | v10.25,31.38 10.38,31.38 12,33 12,35.5 11.62,35.88 11.62,36.25 IC2.27 | v8.88,22.12 8.88,20.88 8.5,20.5 7.38,20.5 CN1.D- | v9.88,3 8,1.12 5,1.12 2.5,3.62 1.88,3.62 1,4.5 1,11.38 v3.5,13.88
  Bottom 0.254: v10.25,31.38 10.25,23.5 v8.88,22.12 8.88,22 8.38,21.5 8.38,17.12 5.12,13.88 v3.5,13.88 | v35.25,14.75 21.62,14.75 v9.88,3
SQW
  Top 0.254: R13.2 37,15.75 37.88,15.75 40,17.88 46,17.88 46.38,18.25 46.38,24 46.12,24.25 36.38,24.25 35.75,24.88 IC1.3
SW  (via drill 0.3)
  Top 0.254: v9.62,32.62 9.5,32.62 8.75,33.38 IC2.32 | v5.62,19.5 6.25,18.88 7.25,18.88 CN1.ID
  Bottom 0.254: v9.62,32.62 9.62,30.12 6.25,26.75 6.25,20.12 v5.62,19.5
VBAT  (via drill 0.3)
  Top 0.254: v5.62,20.5 6.25,21.12 7.25,21.12 CN1.VBUS | v30.12,11.38 28.62,12.88 R17.1
  Bottom 0.254: v5.62,20.5 2.88,17.75 2.88,13.62 3.5,13 3.5,8.5 2.38,7.38 2.38,6.5 SWITCH.2 2.38,6.38 2.38,5.88 7.5,0.75 38.25,0.75 40.75,3.25 -BAT+.2 41,3.12 32.75,11.38 v30.12,11.38